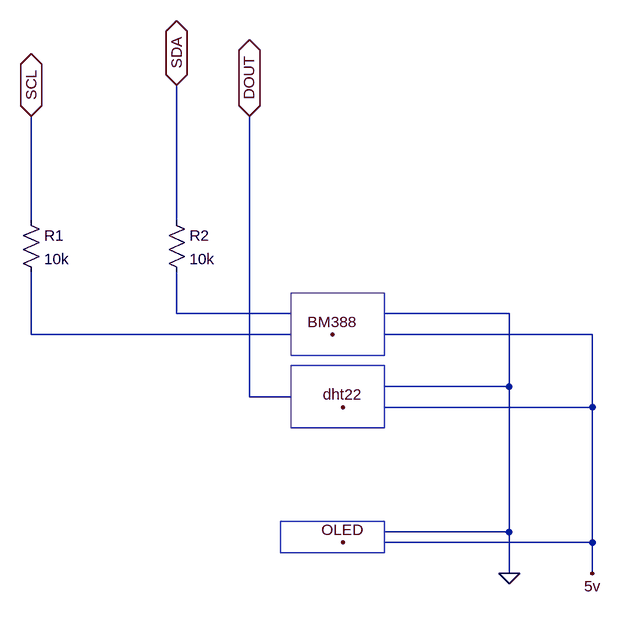
[diagram p0: schematic module_1.asc]
module_1.asc, the LTspice schematic file:
Version 4
SHEET 1 880 680
WIRE -64 -128 -64 -288
WIRE 160 -128 160 -336
WIRE 160 16 160 -48
WIRE 336 16 160 16
WIRE 672 16 480 16
WIRE -64 48 -64 -48
WIRE 336 48 -64 48
WIRE 800 48 480 48
WIRE 672 128 672 16
WIRE 672 128 480 128
WIRE 272 144 272 -288
WIRE 336 144 272 144
WIRE 800 160 800 48
WIRE 800 160 480 160
WIRE 672 352 672 128
WIRE 672 352 480 352
WIRE 800 368 800 160
WIRE 800 368 480 368
WIRE 672 416 672 352
WIRE 800 416 800 368
FLAG 672 416 0
FLAG -64 -288 SCL
IOPIN -64 -288 BiDir
FLAG 160 -336 SDA
IOPIN 160 -336 BiDir
FLAG 400 48 BM388
FLAG 416 160 dht22
FLAG 800 416 5v
FLAG 416 368 OLED
FLAG 272 -288 DOUT
IOPIN 272 -288 BiDir
SYMBOL res -80 -144 R0
SYMATTR InstName R1
SYMATTR Value 10k
SYMBOL res 144 -144 R0
SYMATTR InstName R2
SYMATTR Value 10k
RECTANGLE Normal 480 80 336 -16
RECTANGLE Normal 480 192 336 96
RECTANGLE Normal 480 384 320 336

The netlist it stands for:
* module_1.asc
R1 SCL N002 10k
R2 SDA N001 10k
.backanno
.end